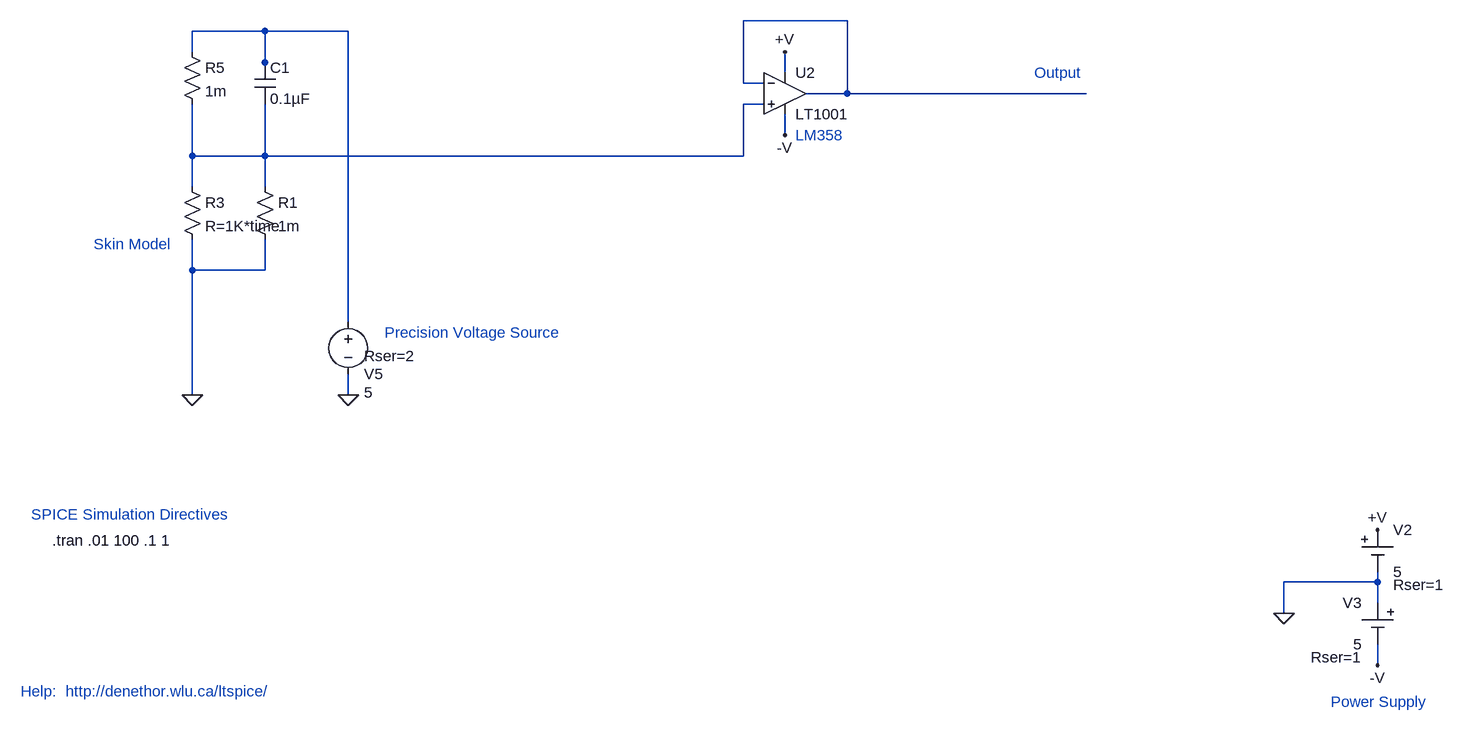
[diagram p0: schematic GSR4.asc]
GSR4.asc, the LTspice schematic file:
Version 4
SHEET 1 1356 1016
WIRE -80 -176 -240 -176
WIRE -976 -160 -1088 -160
WIRE -848 -160 -976 -160
WIRE -1088 -128 -1088 -160
WIRE -976 -112 -976 -160
WIRE -976 -96 -976 -112
WIRE -176 -96 -176 -128
WIRE -240 -80 -240 -176
WIRE -208 -80 -240 -80
WIRE -80 -64 -80 -176
WIRE -80 -64 -144 -64
WIRE 288 -64 -80 -64
WIRE -208 -48 -240 -48
WIRE -176 0 -176 -32
WIRE -1088 32 -1088 -48
WIRE -976 32 -976 -48
WIRE -976 32 -1088 32
WIRE -240 32 -240 -48
WIRE -240 32 -976 32
WIRE -1088 80 -1088 32
WIRE -976 80 -976 32
WIRE -1088 208 -1088 160
WIRE -976 208 -976 160
WIRE -976 208 -1088 208
WIRE -848 288 -848 -160
WIRE -1088 400 -1088 208
WIRE -848 400 -848 368
WIRE 736 688 736 672
WIRE 736 688 592 688
WIRE 736 720 736 688
WIRE 592 736 592 688
WIRE 736 816 736 784
FLAG 736 608 +V
FLAG 736 816 -V
FLAG 592 736 0
FLAG -176 0 -V
FLAG -176 -128 +V
FLAG -848 400 0
FLAG -1088 400 0
SYMBOL Opamps\\LT1001 -176 -128 R0
SYMATTR InstName U2
SYMBOL Misc\\cell 736 608 R0
WINDOW 123 0 0 Left 2
WINDOW 39 24 84 Left 2
SYMATTR SpiceLine Rser=1
SYMATTR InstName V2
SYMATTR Value 5
SYMBOL Misc\\cell 736 720 M0
WINDOW 123 0 0 Left 2
WINDOW 39 24 84 Left 2
SYMATTR SpiceLine Rser=1
SYMATTR InstName V3
SYMATTR Value 5
SYMBOL voltage -848 272 R0
WINDOW 0 24 96 Left 2
WINDOW 3 24 124 Left 2
WINDOW 39 24 68 Left 2
WINDOW 123 0 0 Left 2
SYMATTR InstName V5
SYMATTR Value 5
SYMATTR SpiceLine Rser=2
SYMBOL res -1104 64 R0
SYMATTR InstName R3
SYMATTR Value R=1K*time
SYMBOL res -1104 -144 R0
SYMATTR InstName R5
SYMATTR Value 1m
SYMBOL res -992 64 R0
SYMATTR InstName R1
SYMATTR Value 1m
SYMBOL cap -992 -112 R0
SYMATTR InstName C1
SYMATTR Value 0.1µF
TEXT -1352 856 Left 2 ;Help:  http://denethor.wlu.ca/ltspice/
TEXT -1336 584 Left 2 ;SPICE Simulation Directives
TEXT -1304 624 Left 2 !.tran .01 100 .1 1
TEXT -160 0 Left 2 ;LM358
TEXT 208 -96 Left 2 ;Output
TEXT 664 872 Left 2 ;Power Supply
TEXT -1240 168 Left 2 ;Skin Model
TEXT -792 304 Left 2 ;Precision Voltage Source

The netlist it stands for:
* GSR4.asc
XU2 N003 N001 +V -V N001 LT1001  ; pins In+ In- V+ V- OUT
V2 +V 0 5 Rser=1
V3 0 -V 5 Rser=1
V5 N002 0 5 Rser=2
R3 N003 0 R=1K*time
R5 N002 N003 1m
R1 N003 0 1m
C1 N002 N003 0.1µF
* Help:  http://denethor.wlu.ca/ltspice/
* SPICE Simulation Directives
.tran .01 100 .1 1
* LM358
* Output
* Power Supply
* Skin Model
* Precision Voltage Source
.lib LTC.lib
.backanno
.end